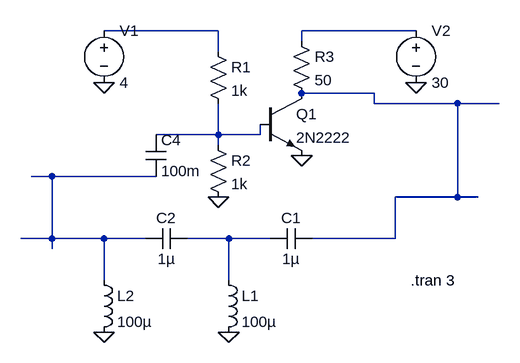
[diagram p0: schematic LC.asc]
LC.asc, the LTspice schematic file:
Version 4
SHEET 1 3464 680
WIRE 112 -96 -64 -96
WIRE 416 -96 240 -96
WIRE 240 -80 240 -96
WIRE 112 -64 112 -96
WIRE 352 0 240 0
WIRE 352 16 352 0
WIRE 480 16 352 16
WIRE 544 16 480 16
WIRE 112 64 112 16
WIRE 112 64 16 64
WIRE 176 64 176 48
WIRE 176 64 112 64
WIRE 112 80 112 64
WIRE -144 128 -176 128
WIRE 16 128 -144 128
WIRE 480 160 480 16
WIRE 480 160 384 160
WIRE 512 160 480 160
WIRE -144 224 -144 128
WIRE -144 224 -192 224
WIRE -64 224 -144 224
WIRE 0 224 -64 224
WIRE 128 224 64 224
WIRE 192 224 128 224
WIRE 384 224 384 160
WIRE 384 224 256 224
WIRE -144 240 -144 224
WIRE -64 288 -64 224
WIRE 128 288 128 224
FLAG 240 96 0
FLAG 112 160 0
FLAG 416 -16 0
FLAG -64 -16 0
FLAG 128 368 0
FLAG -64 368 0
SYMBOL npn 176 0 R0
SYMATTR InstName Q1
SYMATTR Value 2N2222
SYMBOL res 96 -80 R0
SYMATTR InstName R1
SYMATTR Value 1k
SYMBOL res 96 64 R0
SYMATTR InstName R2
SYMATTR Value 1k
SYMBOL voltage 416 -112 R0
WINDOW 123 0 0 Left 0
WINDOW 39 0 0 Left 0
SYMATTR InstName V2
SYMATTR Value 30
SYMBOL cap 0 64 R0
SYMATTR InstName C4
SYMATTR Value 100m
SYMBOL res 224 -96 R0
SYMATTR InstName R3
SYMATTR Value 50
SYMBOL voltage -64 -112 R0
WINDOW 123 0 0 Left 0
WINDOW 39 0 0 Left 0
SYMATTR InstName V1
SYMATTR Value 4
SYMBOL cap 256 208 R90
WINDOW 0 0 32 VBottom 2
WINDOW 3 32 32 VTop 2
SYMATTR InstName C1
SYMATTR Value 1µ
SYMBOL ind 112 272 R0
SYMATTR InstName L1
SYMATTR Value 100µ
SYMBOL ind -80 272 R0
SYMATTR InstName L2
SYMATTR Value 100µ
SYMBOL cap 64 208 R90
WINDOW 0 0 32 VBottom 2
WINDOW 3 32 32 VTop 2
SYMATTR InstName C2
SYMATTR Value 1µ
TEXT 408 288 Left 2 !.tran 3

The netlist it stands for:
* LC.asc
Q1 N003 N004 0 0 2N2222
R1 N001 N004 1k
R2 N004 0 1k
V2 N002 0 30
C4 N004 N005 100m
R3 N002 N003 50
V1 N001 0 4
C1 N003 N006 1µ
L1 N006 0 100µ
L2 N005 0 100µ
C2 N006 N005 1µ
.model NPN NPN
.model PNP PNP
.lib standard.bjt
.tran 3
.backanno
.end